# EAGLE schematic partsFound (EAGLE 7.2.0)
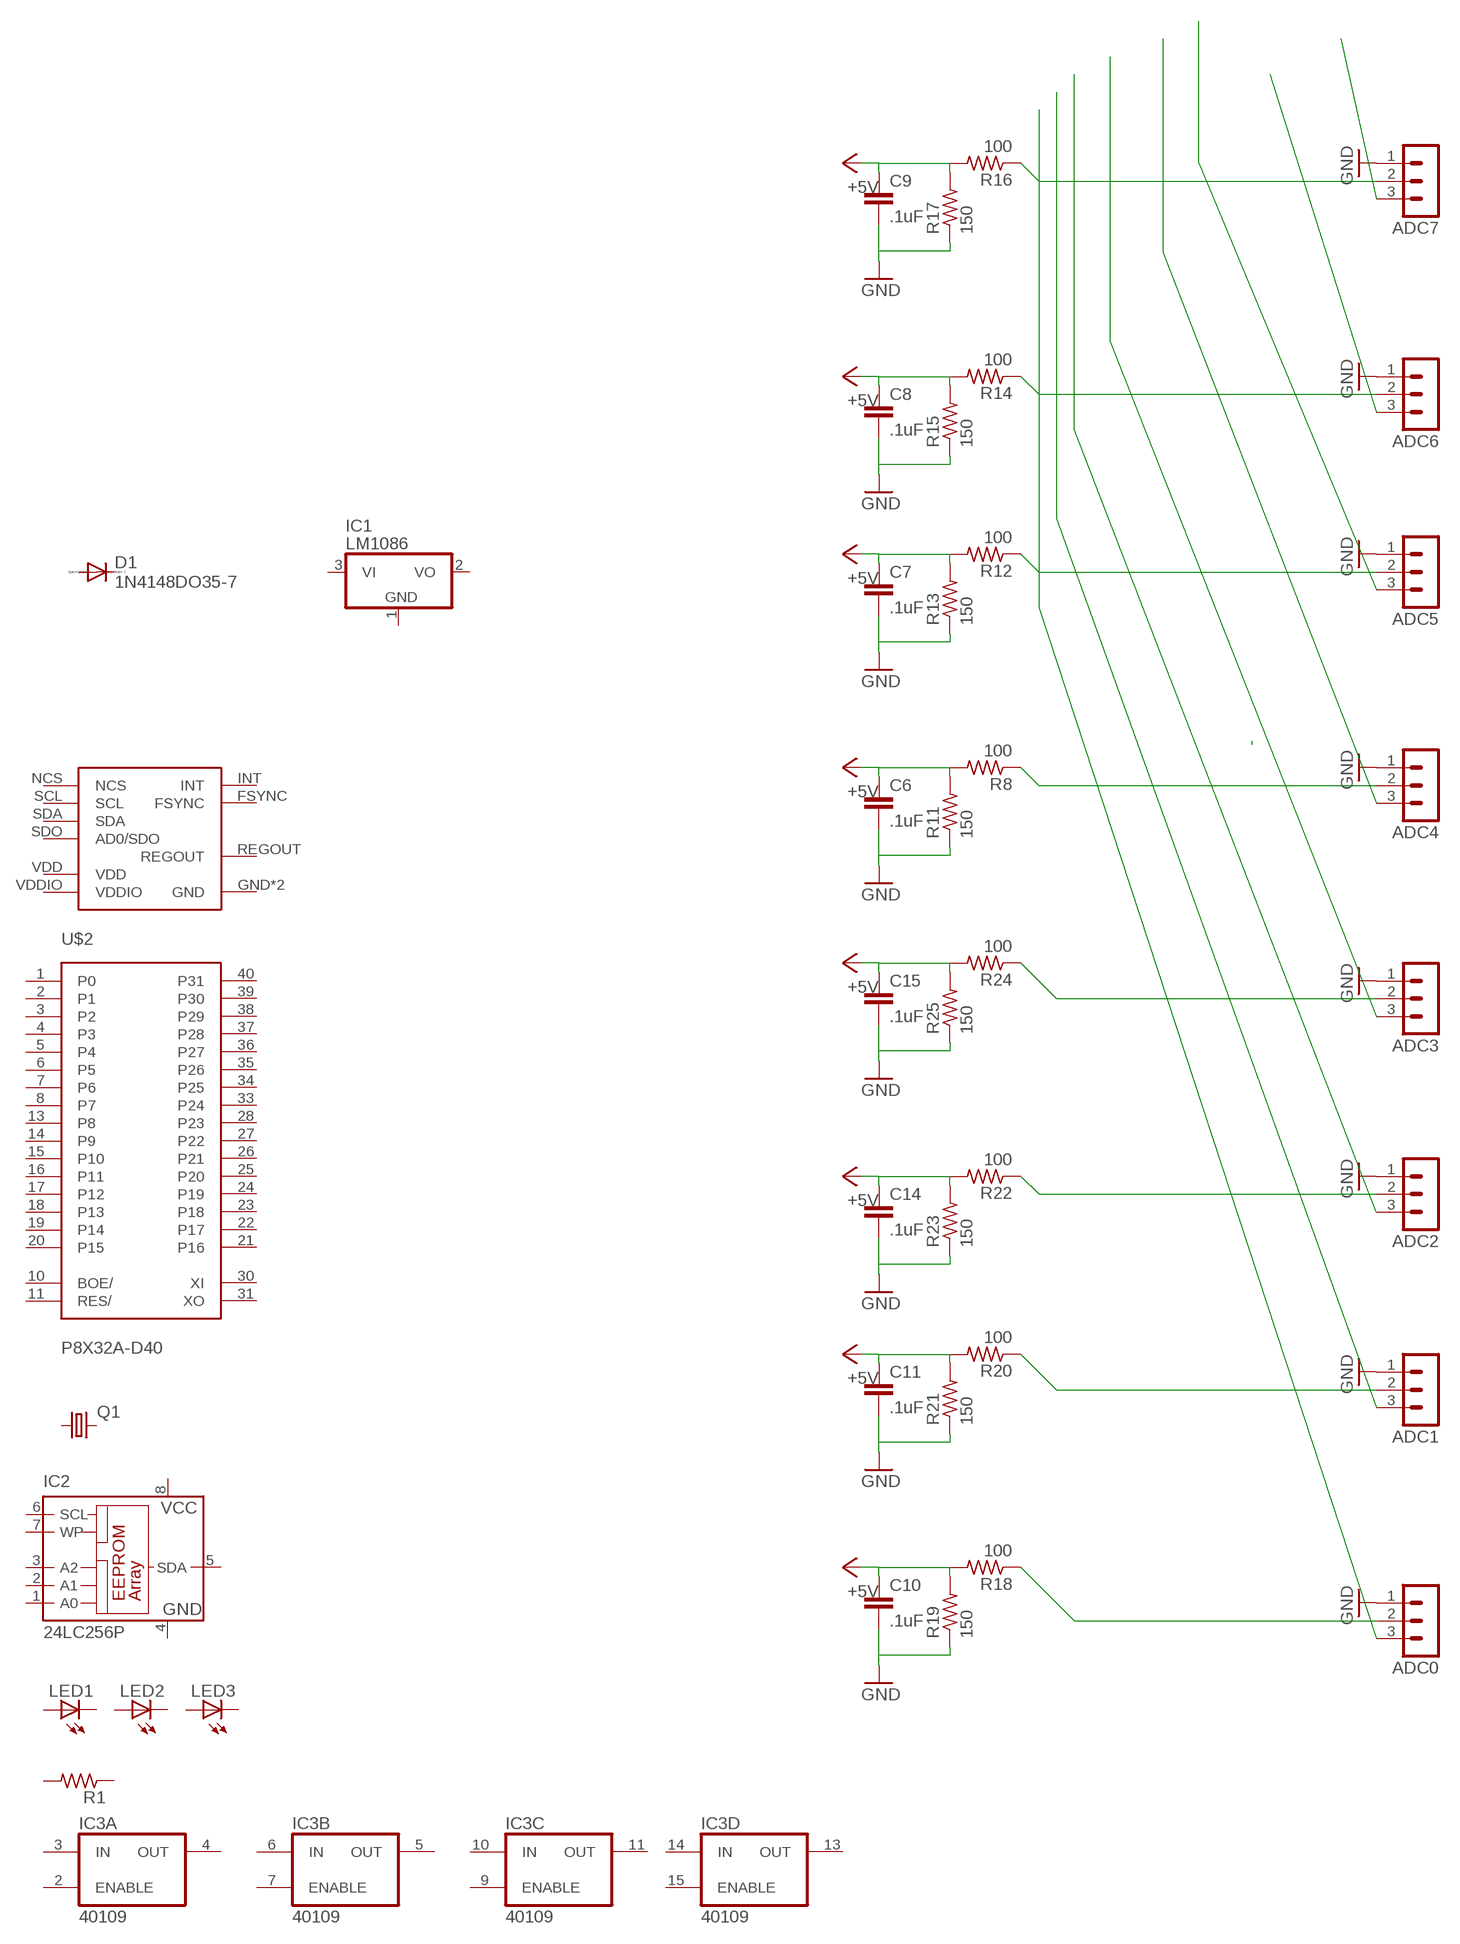
[diagram p0: schematic, sheet 1]

## Parts
ADC0  MA03-1  [MA03-1]
ADC1  MA03-1  [MA03-1]
ADC2  MA03-1  [MA03-1]
ADC3  MA03-1  [MA03-1]
ADC4  MA03-1  [MA03-1]
ADC5  MA03-1  [MA03-1]
ADC6  MA03-1  [MA03-1]
ADC7  MA03-1  [MA03-1]
C6  .1uF  C7.5/6  [C7.5B6]
C7  .1uF  C7.5/6  [C7.5B6]
C8  .1uF  C7.5/6  [C7.5B6]
C9  .1uF  C7.5/6  [C7.5B6]
C10  .1uF  C7.5/6  [C7.5B6]
C11  .1uF  C7.5/6  [C7.5B6]
C14  .1uF  C7.5/6  [C7.5B6]
C15  .1uF  C7.5/6  [C7.5B6]
D1  1N4148DO35-7  [DO35-7]
IC1  LM1086  [TO220V]
IC2  24LC256P  [DIL8]
IC3  40109  [DIL16]
LED1  LED3MM  [LED3MM]
LED2  LED3MM  [LED3MM]
LED3  LED3MM  [LED3MM]
Q1  CRYSTALHC49U70  [HC49U70]
R1  R-US_0207/7  [0207/7]
R8  100  R-US_0309/V  [0309V]
R11  150  R-US_0309/V  [0309V]
R12  100  R-US_0309/V  [0309V]
R13  150  R-US_0309/V  [0309V]
R14  100  R-US_0309/V  [0309V]
R15  150  R-US_0309/V  [0309V]
R16  100  R-US_0309/V  [0309V]
R17  150  R-US_0309/V  [0309V]
R18  100  R-US_0309/V  [0309V]
R19  150  R-US_0309/V  [0309V]
R20  100  R-US_0309/V  [0309V]
R21  150  R-US_0309/V  [0309V]
R22  100  R-US_0309/V  [0309V]
R23  150  R-US_0309/V  [0309V]
R24  100  R-US_0309/V  [0309V]
R25  150  R-US_0309/V  [0309V]
U$1  ITG-3400  [ITG-3400]
U$2  P8X32A-D40  [P8X32A-D40]

## Nets
+5V: C6.1 C7.1 C8.1 C9.1 C10.1 C11.1 C14.1 C15.1 R8.2 R11.2 R12.2 R13.2 R14.2 R15.2 R16.2 R17.2 R18.2 R19.2 R20.2 R21.2 R22.2 R23.2 R24.2 R25.2
GND: ADC0.1 ADC1.1 ADC2.1 ADC3.1 ADC4.1 ADC5.1 ADC6.1 ADC7.1 C6.2 C7.2 C8.2 C9.2 C10.2 C11.2 C14.2 C15.2 R11.1 R13.1 R15.1 R17.1 R19.1 R21.1 R23.1 R25.1
N$3: ADC7.2 R16.1
N$4: ADC6.3
N$5: ADC5.3
N$6: ADC4.3
N$7: ADC3.3
N$8: ADC2.3
N$9: ADC1.3
N$10: ADC0.3
N$25: ADC0.2 R18.1
N$28: ADC1.2 R20.1
N$29: ADC2.2 R22.1
N$30: ADC3.2 R24.1
N$31: ADC4.2 R8.1
N$32: ADC5.2 R12.1
N$33: ADC6.2 R14.1
N$34: ADC7.3
Unconnected: D1.A D1.C IC1.1(GND) IC1.2(VO) IC1.3(VI) IC2.1(A0) IC2.2(A1) IC2.3(A2) IC2.5(SDA) IC2.6(SCL) IC2.7(WP) IC3.2(A:ENABLE) IC3.3(A:IN) IC3.4(A:OUT) IC3.5(B:OUT) IC3.6(B:IN) IC3.7(B:ENABLE) IC3.9(C:ENABLE) IC3.10(C:IN) IC3.11(C:OUT) IC3.13(D:OUT) IC3.14(D:IN) IC3.15(D:ENABLE) LED1.A LED1.K(C) LED2.A LED2.K(C) LED3.A LED3.K(C) Q1.1 Q1.2 R1.1 R1.2 U$1.FSYNC U$1.GND U$1.INT U$1.NCS U$1.REGOUT U$1.RESV-20(GND) U$1.SCL U$1.SDA U$1.SDO(AD0/SDO) U$1.VDD U$1.VDDIO U$2.1(P0) U$2.2(P1) U$2.3(P2) U$2.4(P3) U$2.5(P4) U$2.6(P5) U$2.7(P6) U$2.8(P7) U$2.10(BOE/) U$2.11(RES/) U$2.13(P8) U$2.14(P9) U$2.15(P10) U$2.16(P11) U$2.17(P12) U$2.18(P13) U$2.19(P14) U$2.20(P15) U$2.21(P16) U$2.22(P17) U$2.23(P18) U$2.24(P19) U$2.25(P20) U$2.26(P21) U$2.27(P22) U$2.28(P23) U$2.30(XI) U$2.31(XO) U$2.33(P24) U$2.34(P25) U$2.35(P26) U$2.36(P27) U$2.37(P28) U$2.38(P29) U$2.39(P30) U$2.40(P31)

## Power pins joined to a net without a drawn wire
GND: IC2.4(GND)
VCC: IC2.8(VCC) IC3.1(P:VCC)
VDD: IC3.16(P:VDD) U$2.12(VDD) U$2.32(VDD)
VSS: IC3.8(P:VSS) U$2.9(VSS) U$2.29(VSS)

## Library data of the parts
ADC0 ADC1-ADC7 = con-lstb-modified:MA03-1: PIN HEADER; OC_FARNELL: unknown; OC_NEWARK: unknown
C6-C11 C14 C15 = capacitor-wima:C: CAPACITOR naming: grid - package width
D1 = diode:1N4148: DIODE high speed (Philips)
IC1 = oli:LM1086*: LM1086 1.5A Low Dropout Positive Regulators
IC2 = microchip:24*: Serial EEPROM I2C; MF: MICROCHIP; MPN: 24LC256-E/P; OC_FARNELL: 9757970; OC_NEWARK: 92C7169
IC3 = 40xx-2:40109
LED1-LED3 = led:LED: LED OSRAM: - CHIPLED LG R971, LG N971, LY N971, LG Q971, LY Q971, LO R971, LY R971 LH N974, LH R974 LS Q976, LO Q976, LY Q976 LO Q996 - Hyper CHIPLED LW Q18S LB Q993, LB Q99A, LB R99A - SideLED LS A670, LO A670, LY A670, LG A670, LP A670 LB A673, LV A673, LT A673, LW A673 LH A674 LY A675 LS A676, LA A676, LO A676, LY A676, LW A676 LS A679, LY A679, LG A679 - Hyper Micro SIDELED® LS Y876, LA Y876, LO Y876, LY Y876 LT Y87S - SmartLED LW L88C, LW L88S LB L89C, LB L89S, LG L890 LS L89K, LO L89K, LY L89K LS L896, LA L896, LO L896, LY L896 - TOPLED LS T670, LO T670, LY T670, LG T670, LP T670 LSG T670, LSP T670, LSY T670, LOP T670, LYG T670 LG T671, LOG T671, LSG T671 LB T673, LV T673, LT T673, LW T673 LH T674 LS T676, LA T676, LO T676, LY T676, LB T676, LH T676, LSB T676, LW T676 LB T67C, LV T67C, LT T67C, LS T67K, LO T67K, LY T67K, LW E67C LS E67B, LA E67B, LO E67B, LY E67B, LB E67C, LV E67C, LT E67C LW T67C LS T679, LY T679, LG T679 LS T770, LO T770, LY T770, LG T770, LP T770 LB T773, LV T773, LT T773, LW T773 LH T774 LS E675, LA E675, LY E675, LS T675 LS T776, LA T776, LO T776, LY T776, LB T776 LHGB T686 LT T68C, LB T68C - Hyper Mini TOPLED® LB M676 - Mini TOPLED Santana® LG M470 LS M47K, LO M47K, LY M47K Source: http://www.osram.convergy.de LUXEON: - LUMILED® LXK2-PW12-R00, LXK2-PW12-S00, LXK2-PW14-U00, LXK2-PW14-V00 LXK2-PM12-R00, LXK2-PM12-S00, LXK2-PM14-U00 LXK2-PE12-Q00, LXK2-PE12-R00, LXK2-PE12-S00, LXK2-PE14-T00, LXK2-PE14-U00 LXK2-PB12-K00, LXK2-PB12-L00, LXK2-PB12-M00, LXK2-PB14-N00, LXK2-PB14-P00, LXK2-PB14-Q00 LXK2-PR12-L00, LXK2-PR12-M00, LXK2-PR14-Q00, LXK2-PR14-R00 LXK2-PD12-Q00, LXK2-PD12-R00, LXK2-PD12-S00 LXK2-PH12-R00, LXK2-PH12-S00 LXK2-PL12-P00, LXK2-PL12-Q00, LXK2-PL12-R00 Source: www.luxeon.com KINGBRIGHT: KA-3528ASYC Source: www.kingbright.com
Q1 = crystal:CRYSTAL: CRYSTAL; OC_FARNELL: unknown; OC_NEWARK: unknown
R1 R8 R11-R25 = resistor:R-US_: RESISTOR, American symbol
U$1 = ITG 3400 Gyro:ITG-3400
U$2 = parallax_propeller (1):P8X32A-D40